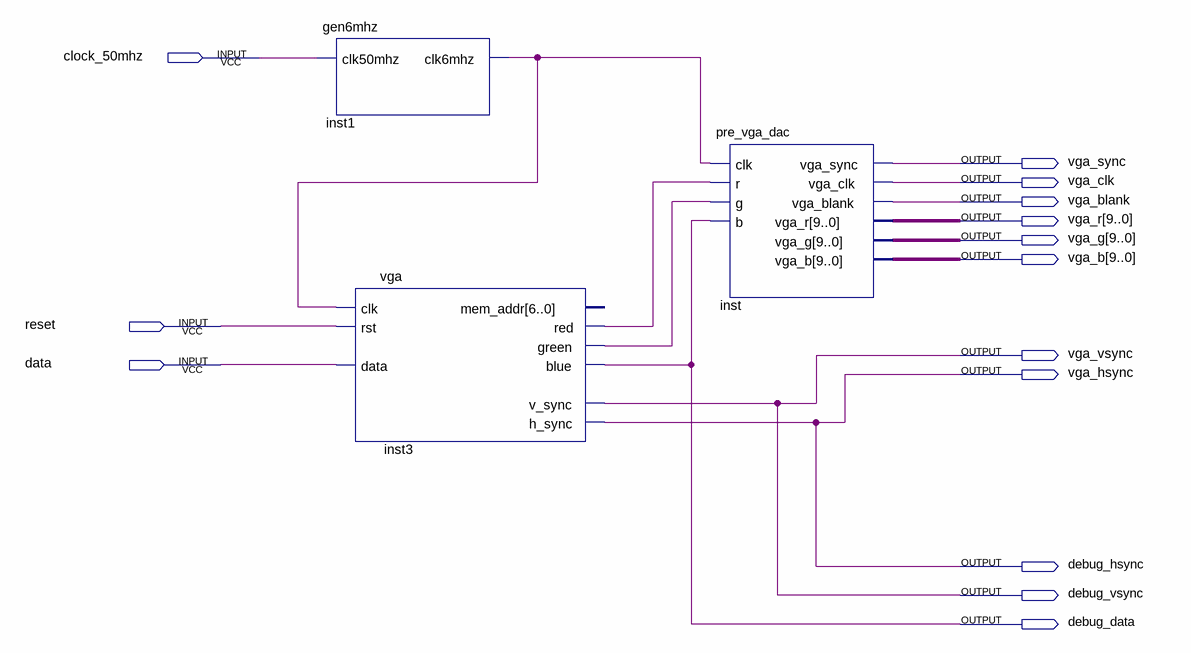
[diagram p0: schematic sheet]
// Quartus schematic top_de2.bdf as structural Verilog: 3 symbols, 14 pins
module top_de2 (
  input  clock_50mhz,
  input  reset,
  input  data,
  output vga_sync,
  output vga_clk,
  output vga_blank,
  output [9:0] vga_r,
  output [9:0] vga_g,
  output [9:0] vga_b,
  output vga_vsync,
  output vga_hsync,
  output debug_hsync,
  output debug_vsync,
  output debug_data
);

  wire inst1_clk6mhz, inst3_green, inst3_red;

  gen6mhz inst1 (.clk50mhz(clock_50mhz), .clk6mhz(inst1_clk6mhz));
  vga inst3 (
    .clk(inst1_clk6mhz), .rst(reset), .data(data), .h_sync(debug_hsync), .v_sync(debug_vsync),
    .red(inst3_red), .green(inst3_green), .blue(debug_data));  // open: mem_addr
  pre_vga_dac inst (
    .clk(inst1_clk6mhz), .r(inst3_red), .g(inst3_green), .b(debug_data), .vga_sync(vga_sync),
    .vga_clk(vga_clk), .vga_blank(vga_blank), .vga_r(vga_r), .vga_g(vga_g), .vga_b(vga_b));

  assign vga_hsync = debug_hsync;
  assign vga_vsync = debug_vsync;
endmodule
